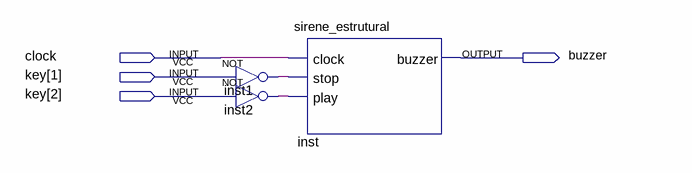
[diagram p0: schematic sheet]
// Quartus schematic buzzer_controlavel.bdf as structural Verilog: 3 symbols, 4 pins
module buzzer_controlavel (
  input  clock,
  input  [2:1] key,
  output buzzer
);

  wire inst1_out, inst2_out;

  not inst1 (inst1_out, key[1]);
  not inst2 (inst2_out, key[2]);
  sirene_estrutural inst (.clock(clock), .stop(inst1_out), .play(inst2_out), .buzzer(buzzer));
endmodule
